# Altium schematic sheet S-8261ABMMD-G3MT2S.schdoc
size 124 x 101 mm
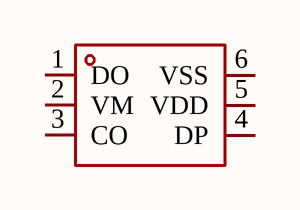
[diagram p0: S-8261ABMMD-G3MT2S.schdoc]

## Parts
U?  S-8261ABMMD-G3MT2S  [SOT-23-6_L2.9-W1.6-P0.95-LS2.8-BL]  (value not drawn)

## Nets

Not connected (* = marked no-connect by the designer): U? 1(DO) 2(VM) 3(CO) 4(DP) 5(VDD) 6(VSS)

## Library data of the parts
U? = S-8261ABMMD-G3MT2S: Manufacturer: ABLIC(艾普凌科); Add into BOM: yes; Symbol: S-8261ABMMD-G3MT2S; Device: S-8261ABMMD-G3MT2S; LCSC Part Name: S-8261ABMMD-G3MT2S; Supplier Part: C468188; Manufacturer Part: S-8261ABMMD-G3MT2S; Supplier Footprint: SOT-23-6; JLCPCB Part Class: Extended Part; Datasheet: https://atta.szlcsc.com/upload/public/pdf/source/20191209/C468214_5E8957BE7A73C8EB459281D88AD78CD7.pdf; Supplier: LCSC; Convert to PCB: yes